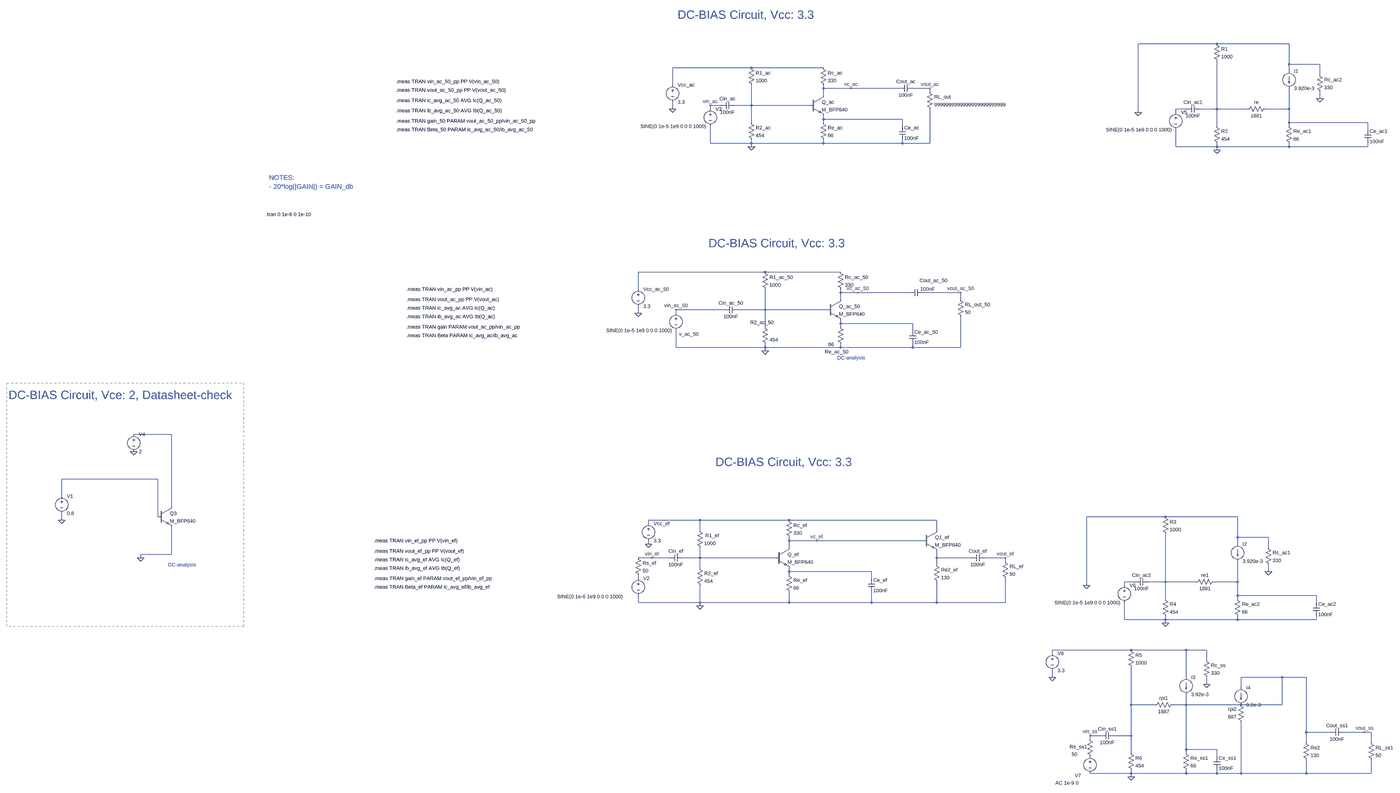
[diagram p0: schematic BP640_AC_3V.asc, whole sheet]
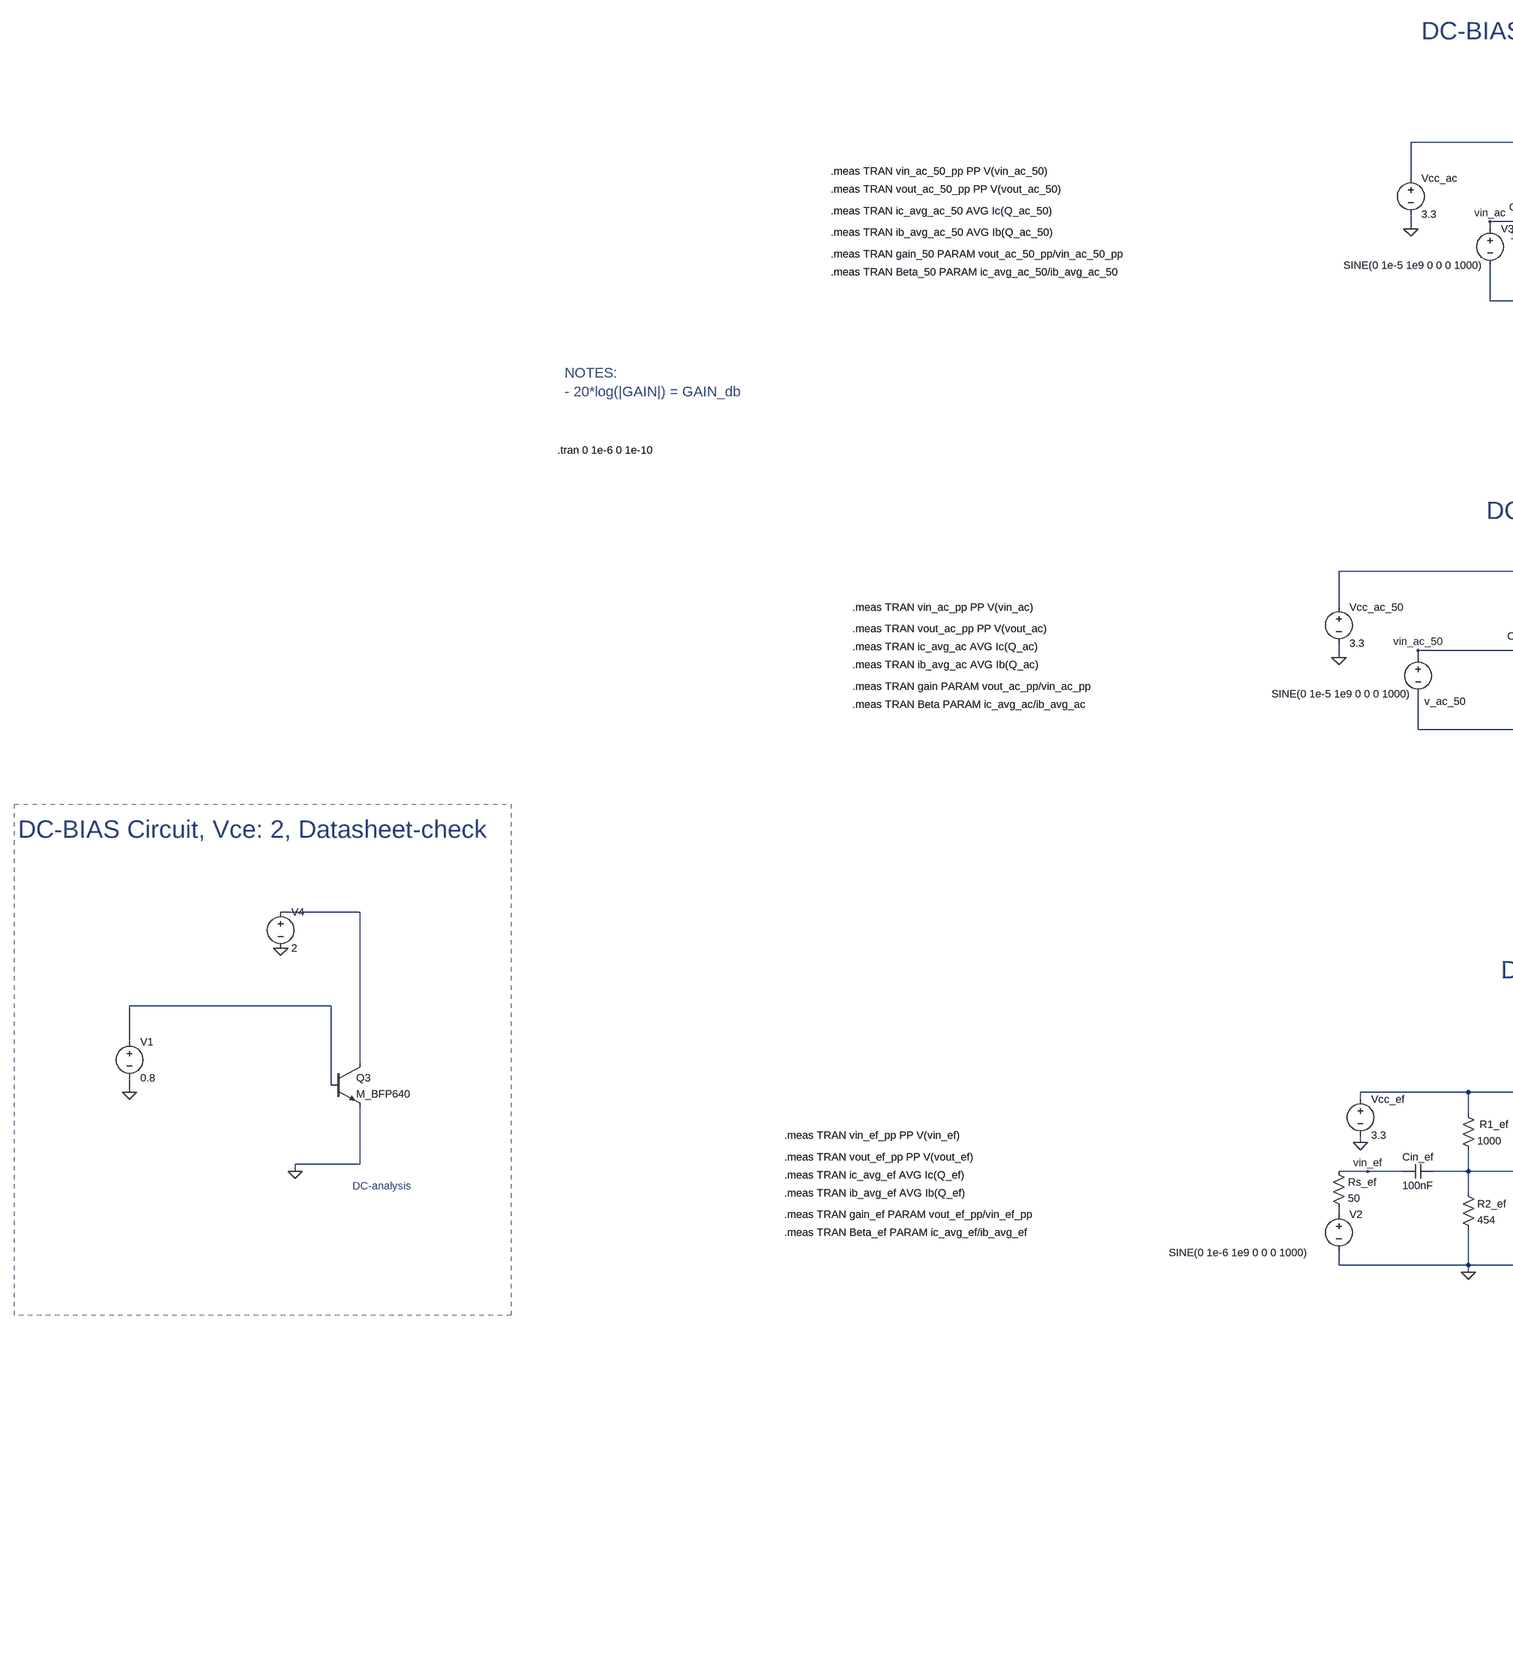
[diagram p1: schematic BP640_AC_3V.asc, part, row 1 of 1, column 1 of 2]
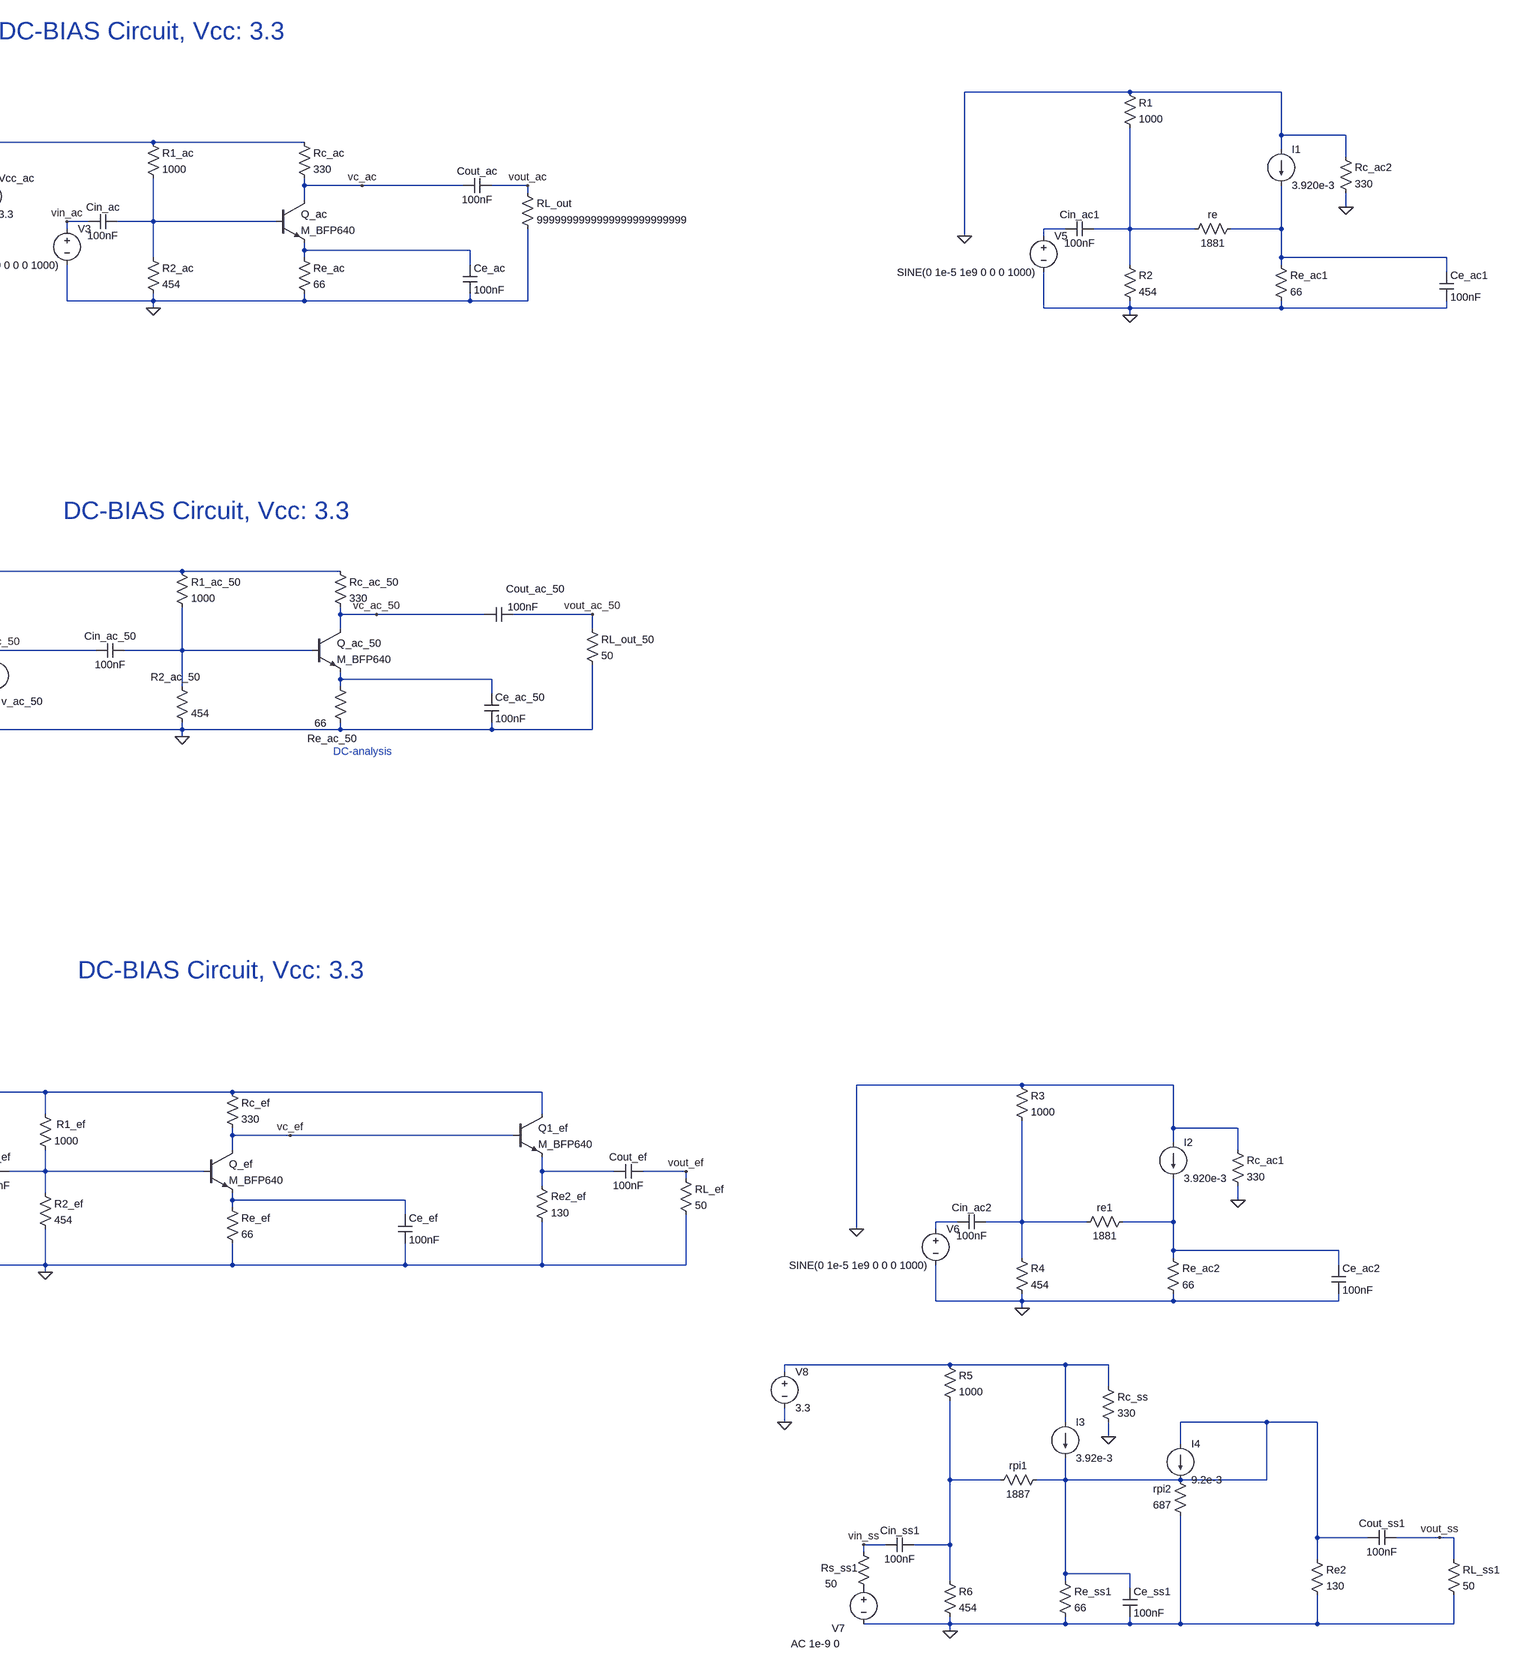
[diagram p2: schematic BP640_AC_3V.asc, part, row 1 of 1, column 2 of 2]
BP640_AC_3V.asc, the LTspice schematic file:
Version 4
SHEET 1 3412 4004
WIRE 2224 -224 1856 -224
WIRE 2560 -224 2224 -224
WIRE 2560 -128 2560 -224
WIRE 2704 -128 2560 -128
WIRE -352 -112 -720 -112
WIRE -16 -112 -352 -112
WIRE 2560 -96 2560 -128
WIRE 2704 -80 2704 -128
WIRE -720 -32 -720 -112
WIRE -16 -16 -16 -32
WIRE 112 -16 -16 -16
WIRE 336 -16 112 -16
WIRE 480 -16 400 -16
WIRE 480 0 480 -16
WIRE -16 16 -16 -16
WIRE 2704 32 2704 0
WIRE -496 64 -544 64
WIRE -352 64 -352 -32
WIRE -352 64 -432 64
WIRE -80 64 -352 64
WIRE -720 80 -720 48
WIRE -544 80 -544 64
WIRE 2080 80 2032 80
WIRE 2224 80 2224 -144
WIRE 2224 80 2144 80
WIRE 2368 80 2224 80
WIRE 2560 80 2560 -16
WIRE 2560 80 2448 80
WIRE 1856 96 1856 -224
WIRE 2032 96 2032 80
WIRE -16 128 -16 112
WIRE 352 128 -16 128
WIRE -352 144 -352 64
WIRE -16 144 -16 128
WIRE 2560 144 2560 80
WIRE 2928 144 2560 144
WIRE 352 160 352 128
WIRE 2224 160 2224 80
WIRE 2560 160 2560 144
WIRE 2928 176 2928 144
WIRE -544 240 -544 160
WIRE -352 240 -352 224
WIRE -352 240 -544 240
WIRE -16 240 -16 224
WIRE -16 240 -352 240
WIRE 352 240 352 224
WIRE 352 240 -16 240
WIRE 480 240 480 80
WIRE 480 240 352 240
WIRE -352 256 -352 240
WIRE 2032 256 2032 176
WIRE 2224 256 2224 240
WIRE 2224 256 2032 256
WIRE 2560 256 2560 240
WIRE 2560 256 2224 256
WIRE 2928 256 2928 240
WIRE 2928 256 2560 256
WIRE 2224 272 2224 256
WIRE -288 1216 -880 1216
WIRE 64 1216 -288 1216
WIRE -880 1296 -880 1216
WIRE 64 1312 64 1296
WIRE 144 1312 64 1312
WIRE 384 1312 144 1312
WIRE 624 1312 448 1312
WIRE 64 1344 64 1312
WIRE 624 1344 624 1312
WIRE -480 1392 -704 1392
WIRE -288 1392 -288 1296
WIRE -288 1392 -416 1392
WIRE 0 1392 -288 1392
WIRE -880 1408 -880 1376
WIRE -704 1408 -704 1392
WIRE 64 1456 64 1440
WIRE 400 1456 64 1456
WIRE -288 1472 -288 1392
WIRE 64 1472 64 1456
WIRE 400 1488 400 1456
WIRE -704 1568 -704 1488
WIRE -288 1568 -288 1552
WIRE -288 1568 -704 1568
WIRE 64 1568 64 1552
WIRE 64 1568 -288 1568
WIRE 400 1568 400 1552
WIRE 400 1568 64 1568
WIRE 624 1568 624 1424
WIRE 624 1568 400 1568
WIRE -288 1584 -288 1568
WIRE -3680 2112 -3856 2112
WIRE -3744 2320 -4192 2320
WIRE -4192 2400 -4192 2320
WIRE -3680 2448 -3680 2112
WIRE -3744 2496 -3744 2320
WIRE 1984 2496 1616 2496
WIRE 2320 2496 1984 2496
WIRE -4192 2512 -4192 2480
WIRE -592 2512 -832 2512
WIRE -176 2512 -592 2512
WIRE 512 2512 -176 2512
WIRE -832 2528 -832 2512
WIRE -592 2560 -592 2512
WIRE 512 2560 512 2512
WIRE 2320 2592 2320 2496
WIRE 2464 2592 2320 2592
WIRE -176 2608 -176 2592
WIRE -48 2608 -176 2608
WIRE 448 2608 -48 2608
WIRE -832 2624 -832 2608
WIRE 2320 2624 2320 2592
WIRE -176 2640 -176 2608
WIRE 2464 2640 2464 2592
WIRE -3680 2672 -3680 2544
WIRE -3680 2672 -3824 2672
WIRE -3824 2688 -3824 2672
WIRE -816 2688 -880 2688
WIRE -736 2688 -816 2688
WIRE -592 2688 -592 2640
WIRE -592 2688 -672 2688
WIRE -240 2688 -592 2688
WIRE 512 2688 512 2656
WIRE 672 2688 512 2688
WIRE 832 2688 736 2688
WIRE 832 2704 832 2688
WIRE 512 2720 512 2688
WIRE -592 2736 -592 2688
WIRE -176 2752 -176 2736
WIRE 208 2752 -176 2752
WIRE 2464 2752 2464 2720
WIRE -176 2768 -176 2752
WIRE -880 2784 -880 2768
WIRE 208 2784 208 2752
WIRE 1840 2800 1792 2800
WIRE 1984 2800 1984 2576
WIRE 1984 2800 1904 2800
WIRE 2128 2800 1984 2800
WIRE 2320 2800 2320 2704
WIRE 2320 2800 2208 2800
WIRE 1616 2816 1616 2496
WIRE 1792 2816 1792 2800
WIRE 2320 2864 2320 2800
WIRE 2688 2864 2320 2864
WIRE 1984 2880 1984 2800
WIRE 2320 2880 2320 2864
WIRE -880 2896 -880 2864
WIRE -592 2896 -592 2816
WIRE -592 2896 -880 2896
WIRE -176 2896 -176 2848
WIRE -176 2896 -592 2896
WIRE 208 2896 208 2848
WIRE 208 2896 -176 2896
WIRE 512 2896 512 2800
WIRE 512 2896 208 2896
WIRE 832 2896 832 2784
WIRE 832 2896 512 2896
WIRE 2688 2896 2688 2864
WIRE -592 2912 -592 2896
WIRE 1792 2976 1792 2896
WIRE 1984 2976 1984 2960
WIRE 1984 2976 1792 2976
WIRE 2320 2976 2320 2960
WIRE 2320 2976 1984 2976
WIRE 2688 2976 2688 2960
WIRE 2688 2976 2320 2976
WIRE 1984 2992 1984 2976
WIRE 1824 3296 1456 3296
WIRE 2080 3296 1824 3296
WIRE 2176 3296 2080 3296
WIRE 1456 3312 1456 3296
WIRE 2176 3344 2176 3296
WIRE 1456 3424 1456 3392
WIRE 2080 3424 2080 3296
WIRE 2528 3424 2336 3424
WIRE 2640 3424 2528 3424
WIRE 2176 3456 2176 3424
WIRE 2336 3472 2336 3424
WIRE 1824 3552 1824 3376
WIRE 1936 3552 1824 3552
WIRE 2080 3552 2080 3504
WIRE 2080 3552 2016 3552
WIRE 2336 3552 2080 3552
WIRE 2528 3552 2528 3424
WIRE 2528 3552 2336 3552
WIRE 2640 3680 2640 3424
WIRE 2752 3680 2640 3680
WIRE 2912 3680 2816 3680
WIRE 2944 3680 2912 3680
WIRE 1680 3696 1632 3696
WIRE 1824 3696 1824 3552
WIRE 1824 3696 1744 3696
WIRE 1632 3712 1632 3696
WIRE 2640 3728 2640 3680
WIRE 2944 3728 2944 3680
WIRE 2080 3760 2080 3552
WIRE 2224 3760 2080 3760
WIRE 1824 3776 1824 3696
WIRE 2080 3776 2080 3760
WIRE 2224 3792 2224 3760
WIRE 1824 3872 1824 3856
WIRE 1824 3872 1632 3872
WIRE 2080 3872 2080 3856
WIRE 2080 3872 1824 3872
WIRE 2224 3872 2224 3856
WIRE 2224 3872 2080 3872
WIRE 2336 3872 2336 3632
WIRE 2336 3872 2224 3872
WIRE 2640 3872 2640 3808
WIRE 2640 3872 2336 3872
WIRE 2944 3872 2944 3808
WIRE 2944 3872 2640 3872
WIRE 1824 3888 1824 3872
FLAG -720 80 0
FLAG -352 256 0
FLAG -4192 2512 0
FLAG -3824 2688 0
FLAG -3856 2192 0
FLAG -880 1408 0
FLAG -288 1584 0
FLAG -704 1392 vin_ac_50
FLAG 624 1312 vout_ac_50
FLAG -544 64 vin_ac
FLAG 480 -16 vout_ac
FLAG 112 -16 vc_ac
FLAG 144 1312 vc_ac_50
FLAG -832 2624 0
FLAG -592 2912 0
FLAG -816 2688 vin_ef
FLAG 832 2688 vout_ef
FLAG -48 2608 vc_ef
FLAG 1856 96 0
FLAG 2224 272 0
FLAG 2704 32 0
FLAG 1616 2816 0
FLAG 1984 2992 0
FLAG 2464 2752 0
FLAG 1456 3424 0
FLAG 1824 3888 0
FLAG 1632 3696 vin_ss
FLAG 2912 3680 vout_ss
FLAG 2176 3456 0
DATAFLAG 64 1312 ""
DATAFLAG 64 1328 ""
SYMBOL voltage -720 -48 R0
WINDOW 123 0 0 Left 0
WINDOW 39 0 0 Left 0
SYMATTR InstName Vcc_ac
SYMATTR Value 3.3
SYMBOL npn -80 16 R0
SYMATTR InstName Q_ac
SYMATTR Value M_BFP640
SYMBOL res -368 -128 R0
SYMATTR InstName R1_ac
SYMATTR Value 1000
SYMBOL res -368 128 R0
SYMATTR InstName R2_ac
SYMATTR Value 454
SYMBOL res -32 128 R0
SYMATTR InstName Re_ac
SYMATTR Value 66
SYMBOL res -32 -128 R0
SYMATTR InstName Rc_ac
SYMATTR Value 330
SYMBOL voltage -4192 2384 R0
WINDOW 123 0 0 Left 0
WINDOW 39 0 0 Left 0
SYMATTR InstName V1
SYMATTR Value 0.8
SYMBOL npn -3744 2448 R0
SYMATTR InstName Q3
SYMATTR Value M_BFP640
SYMBOL voltage -3856 2096 R0
WINDOW 123 0 0 Left 0
WINDOW 39 0 0 Left 0
SYMATTR InstName V4
SYMATTR Value 2
SYMBOL res 464 -16 R0
SYMATTR InstName RL_out
SYMATTR Value 9999999999999999999999999
SYMBOL cap 336 160 R0
SYMATTR InstName Ce_ac
SYMATTR Value 100nF
SYMBOL cap 400 -32 R90
WINDOW 0 0 32 VBottom 2
WINDOW 3 32 32 VTop 2
SYMATTR InstName Cout_ac
SYMATTR Value 100nF
SYMBOL cap -432 48 R90
WINDOW 0 0 32 VBottom 2
WINDOW 3 32 32 VTop 2
SYMATTR InstName Cin_ac
SYMATTR Value 100nF
SYMBOL voltage -544 64 R0
WINDOW 3 -326 97 Left 2
WINDOW 123 0 0 Left 0
WINDOW 39 0 0 Left 0
SYMATTR Value SINE(0 1e-5 1e9 0 0 0 1000)
SYMATTR InstName V3
SYMBOL voltage -880 1280 R0
WINDOW 123 0 0 Left 0
WINDOW 39 0 0 Left 0
SYMATTR InstName Vcc_ac_50
SYMATTR Value 3.3
SYMBOL npn 0 1344 R0
SYMATTR InstName Q_ac_50
SYMATTR Value M_BFP640
SYMBOL res -304 1200 R0
SYMATTR InstName R1_ac_50
SYMATTR Value 1000
SYMBOL res -304 1456 R0
WINDOW 0 -54 -5 Left 2
SYMATTR InstName R2_ac_50
SYMATTR Value 454
SYMBOL res 48 1456 R0
WINDOW 0 -58 132 Left 2
WINDOW 3 -42 98 Left 2
SYMATTR InstName Re_ac_50
SYMATTR Value 66
SYMBOL res 48 1200 R0
SYMATTR InstName Rc_ac_50
SYMATTR Value 330
SYMBOL res 608 1328 R0
SYMATTR InstName RL_out_50
SYMATTR Value 50
SYMBOL cap 384 1488 R0
SYMATTR InstName Ce_ac_50
SYMATTR Value 100nF
SYMBOL cap 448 1296 R90
WINDOW 0 -25 -49 VBottom 2
WINDOW 3 -16 -22 VTop 2
SYMATTR InstName Cout_ac_50
SYMATTR Value 100nF
SYMBOL cap -416 1376 R90
WINDOW 0 0 32 VBottom 2
WINDOW 3 32 32 VTop 2
SYMATTR InstName Cin_ac_50
SYMATTR Value 100nF
SYMBOL voltage -704 1392 R0
WINDOW 0 14 113 Left 2
WINDOW 3 -326 97 Left 2
WINDOW 123 0 0 Left 0
WINDOW 39 0 0 Left 0
SYMATTR InstName v_ac_50
SYMATTR Value SINE(0 1e-5 1e9 0 0 0 1000)
SYMBOL voltage -832 2512 R0
WINDOW 123 0 0 Left 0
WINDOW 39 0 0 Left 0
SYMATTR InstName Vcc_ef
SYMATTR Value 3.3
SYMBOL npn -240 2640 R0
SYMATTR InstName Q_ef
SYMATTR Value M_BFP640
SYMBOL res -608 2544 R0
WINDOW 0 41 40 Left 2
SYMATTR InstName R1_ef
SYMATTR Value 1000
SYMBOL res -608 2720 R0
SYMATTR InstName R2_ef
SYMATTR Value 454
SYMBOL res -192 2752 R0
SYMATTR InstName Re_ef
SYMATTR Value 66
SYMBOL res -192 2496 R0
SYMATTR InstName Rc_ef
SYMATTR Value 330
SYMBOL res 816 2688 R0
SYMATTR InstName RL_ef
SYMATTR Value 50
SYMBOL cap 192 2784 R0
SYMATTR InstName Ce_ef
SYMATTR Value 100nF
SYMBOL cap 736 2672 R90
WINDOW 0 0 32 VBottom 2
WINDOW 3 32 32 VTop 2
SYMATTR InstName Cout_ef
SYMATTR Value 100nF
SYMBOL cap -672 2672 R90
WINDOW 0 0 32 VBottom 2
WINDOW 3 32 32 VTop 2
SYMATTR InstName Cin_ef
SYMATTR Value 100nF
SYMBOL voltage -880 2768 R0
WINDOW 3 -378 101 Left 2
WINDOW 123 0 0 Left 0
WINDOW 39 0 0 Left 0
SYMATTR Value SINE(0 1e-6 1e9 0 0 0 1000)
SYMATTR InstName V2
SYMBOL npn 448 2560 R0
SYMATTR InstName Q1_ef
SYMATTR Value M_BFP640
SYMBOL res 496 2704 R0
SYMATTR InstName Re2_ef
SYMATTR Value 130
SYMBOL res -896 2672 R0
SYMATTR InstName Rs_ef
SYMATTR Value 50
SYMBOL res 2208 -240 R0
SYMATTR InstName R1
SYMATTR Value 1000
SYMBOL res 2208 144 R0
SYMATTR InstName R2
SYMATTR Value 454
SYMBOL res 2544 144 R0
SYMATTR InstName Re_ac1
SYMATTR Value 66
SYMBOL cap 2912 176 R0
SYMATTR InstName Ce_ac1
SYMATTR Value 100nF
SYMBOL cap 2144 64 R90
WINDOW 0 0 32 VBottom 2
WINDOW 3 32 32 VTop 2
SYMATTR InstName Cin_ac1
SYMATTR Value 100nF
SYMBOL voltage 2032 80 R0
WINDOW 3 -326 97 Left 2
WINDOW 123 0 0 Left 0
WINDOW 39 0 0 Left 0
SYMATTR Value SINE(0 1e-5 1e9 0 0 0 1000)
SYMATTR InstName V5
SYMBOL current 2560 -96 R0
WINDOW 123 0 0 Left 0
WINDOW 39 0 0 Left 0
SYMATTR InstName I1
SYMATTR Value 3.920e-3
SYMBOL res 2464 64 R90
WINDOW 0 0 56 VBottom 2
WINDOW 3 32 56 VTop 2
SYMATTR InstName re
SYMATTR Value 1881
SYMBOL res 2688 -96 R0
SYMATTR InstName Rc_ac2
SYMATTR Value 330
SYMBOL res 1968 2480 R0
SYMATTR InstName R3
SYMATTR Value 1000
SYMBOL res 1968 2864 R0
SYMATTR InstName R4
SYMATTR Value 454
SYMBOL res 2304 2864 R0
SYMATTR InstName Re_ac2
SYMATTR Value 66
SYMBOL cap 2672 2896 R0
SYMATTR InstName Ce_ac2
SYMATTR Value 100nF
SYMBOL cap 1904 2784 R90
WINDOW 0 0 32 VBottom 2
WINDOW 3 32 32 VTop 2
SYMATTR InstName Cin_ac2
SYMATTR Value 100nF
SYMBOL voltage 1792 2800 R0
WINDOW 3 -326 97 Left 2
WINDOW 123 0 0 Left 0
WINDOW 39 0 0 Left 0
SYMATTR Value SINE(0 1e-5 1e9 0 0 0 1000)
SYMATTR InstName V6
SYMBOL current 2320 2624 R0
WINDOW 123 0 0 Left 0
WINDOW 39 0 0 Left 0
SYMATTR InstName I2
SYMATTR Value 3.920e-3
SYMBOL res 2224 2784 R90
WINDOW 0 0 56 VBottom 2
WINDOW 3 32 56 VTop 2
SYMATTR InstName re1
SYMATTR Value 1881
SYMBOL res 2448 2624 R0
SYMATTR InstName Rc_ac1
SYMATTR Value 330
SYMBOL res 1808 3280 R0
SYMATTR InstName R5
SYMATTR Value 1000
SYMBOL res 1808 3760 R0
SYMATTR InstName R6
SYMATTR Value 454
SYMBOL res 2064 3760 R0
SYMATTR InstName Re_ss1
SYMATTR Value 66
SYMBOL res 2160 3328 R0
SYMATTR InstName Rc_ss
SYMATTR Value 330
SYMBOL cap 2208 3792 R0
SYMATTR InstName Ce_ss1
SYMATTR Value 100nF
SYMBOL cap 1744 3680 R90
WINDOW 0 0 32 VBottom 2
WINDOW 3 32 32 VTop 2
SYMATTR InstName Cin_ss1
SYMATTR Value 100nF
SYMBOL res 2624 3712 R0
SYMATTR InstName Re2
SYMATTR Value 130
SYMBOL voltage 1632 3776 R0
WINDOW 123 -162 140 Left 2
WINDOW 39 0 0 Left 0
WINDOW 0 -71 106 Left 2
SYMATTR Value2 AC 1e-9 0
SYMATTR InstName V7
SYMATTR Value ""
SYMBOL cap 2816 3664 R90
WINDOW 0 0 32 VBottom 2
WINDOW 3 32 32 VTop 2
SYMATTR InstName Cout_ss1
SYMATTR Value 100nF
SYMBOL res 2928 3712 R0
SYMATTR InstName RL_ss1
SYMATTR Value 50
SYMBOL res 1616 3696 R0
WINDOW 0 -79 52 Left 2
WINDOW 3 -70 87 Left 2
SYMATTR InstName Rs_ss1
SYMATTR Value 50
SYMBOL voltage 1456 3296 R0
WINDOW 123 0 0 Left 0
WINDOW 39 0 0 Left 0
SYMATTR InstName V8
SYMATTR Value 3.3
SYMBOL res 2032 3536 R90
WINDOW 0 0 56 VBottom 2
WINDOW 3 32 56 VTop 2
SYMATTR InstName rpi1
SYMATTR Value 1887
SYMBOL current 2080 3424 R0
WINDOW 123 0 0 Left 0
WINDOW 39 0 0 Left 0
SYMATTR InstName I3
SYMATTR Value 3.92e-3
SYMBOL res 2352 3648 R180
WINDOW 0 36 76 Left 2
WINDOW 3 36 40 Left 2
SYMATTR InstName rpi2
SYMATTR Value 687
SYMBOL current 2336 3472 R0
WINDOW 123 0 0 Left 0
WINDOW 39 0 0 Left 0
SYMATTR InstName I4
SYMATTR Value 9.2e-3
TEXT -2704 624 Left 2 !.tran 0 1e-6 0 1e-10
TEXT -696 -440 Left 5 ;DC-BIAS Circuit, Vcc: 3.3
TEXT -3696 2720 Left 2 ;DC-analysis
TEXT -4440 1928 Left 5 ;DC-BIAS Circuit, Vce: 2, Datasheet-check
TEXT 48 1616 Left 2 ;DC-analysis
TEXT -552 936 Left 5 ;DC-BIAS Circuit, Vcc: 3.3
TEXT -2688 400 Left 3 ;NOTES:\n- 20*log(|GAIN|) = GAIN_db
TEXT -2096 -48 Left 2 !.meas TRAN vin_ac_50_pp PP V(vin_ac_50)
TEXT -2096 -8 Left 2 !.meas TRAN vout_ac_50_pp PP V(vout_ac_50)
TEXT -2048 1296 Left 2 !.meas TRAN vin_ac_pp PP V(vin_ac)
TEXT -2048 1344 Left 2 !.meas TRAN vout_ac_pp PP V(vout_ac)
TEXT -2096 40 Left 2 !.meas TRAN ic_avg_ac_50 AVG Ic(Q_ac_50)
TEXT -2096 88 Left 2 !.meas TRAN ib_avg_ac_50 AVG Ib(Q_ac_50)
TEXT -2048 1384 Left 2 !.meas TRAN ic_avg_ac AVG Ic(Q_ac)
TEXT -2048 1424 Left 2 !.meas TRAN ib_avg_ac AVG Ib(Q_ac)
TEXT -2096 136 Left 2 !.meas TRAN gain_50 PARAM vout_ac_50_pp/vin_ac_50_pp
TEXT -2096 176 Left 2 !.meas TRAN Beta_50 PARAM ic_avg_ac_50/ib_avg_ac_50
TEXT -2048 1472 Left 2 !.meas TRAN gain PARAM vout_ac_pp/vin_ac_pp
TEXT -2048 1512 Left 2 !.meas TRAN Beta PARAM ic_avg_ac/ib_avg_ac
TEXT -520 2240 Left 5 ;DC-BIAS Circuit, Vcc: 3.3
TEXT -2200 2608 Left 2 !.meas TRAN vin_ef_pp PP V(vin_ef)
TEXT -2200 2656 Left 2 !.meas TRAN vout_ef_pp PP V(vout_ef)
TEXT -2200 2696 Left 2 !.meas TRAN ic_avg_ef AVG Ic(Q_ef)
TEXT -2200 2736 Left 2 !.meas TRAN ib_avg_ef AVG Ib(Q_ef)
TEXT -2200 2784 Left 2 !.meas TRAN gain_ef PARAM vout_ef_pp/vin_ef_pp
TEXT -2200 2824 Left 2 !.meas TRAN Beta_ef PARAM ic_avg_ef/ib_avg_ef
RECTANGLE Normal -3344 3008 -4448 1872 2

The netlist it stands for:
* BP640_AC_3V.asc
Vcc_ac N001 0 3.3
Q_ac vc_ac N002 N006 0 M_BFP640
R1_ac N001 N002 1000
R2_ac N002 0 454
Re_ac N006 0 66
Rc_ac N001 vc_ac 330
V1 N011 0 0.8
Q3 N010 N011 0 0 M_BFP640
V4 N010 0 2
RL_out vout_ac 0 9999999999999999999999999
Ce_ac N006 0 100nF
Cout_ac vout_ac vc_ac 100nF
Cin_ac N002 vin_ac 100nF
V3 vin_ac 0 SINE(0 1e-5 1e9 0 0 0 1000)
Vcc_ac_50 N007 0 3.3
Q_ac_50 vc_ac_50 N008 N009 0 M_BFP640
R1_ac_50 N007 N008 1000
R2_ac_50 N008 0 454
Re_ac_50 N009 0 66
Rc_ac_50 N007 vc_ac_50 330
RL_out_50 vout_ac_50 0 50
Ce_ac_50 N009 0 100nF
Cout_ac_50 vout_ac_50 vc_ac_50 100nF
Cin_ac_50 N008 vin_ac_50 100nF
v_ac_50 vin_ac_50 0 SINE(0 1e-5 1e9 0 0 0 1000)
Vcc_ef N012 0 3.3
Q_ef vc_ef N013 N015 0 M_BFP640
R1_ef N012 N013 1000
R2_ef N013 0 454
Re_ef N015 0 66
Rc_ef N012 vc_ef 330
RL_ef vout_ef 0 50
Ce_ef N015 0 100nF
Cout_ef vout_ef N014 100nF
Cin_ef N013 vin_ef 100nF
V2 N016 0 SINE(0 1e-6 1e9 0 0 0 1000)
Q1_ef N012 vc_ef N014 0 M_BFP640
Re2_ef N014 0 130
Rs_ef vin_ef N016 50
R1 0 N004 1000
R2 N004 0 454
Re_ac1 N005 0 66
Ce_ac1 N005 0 100nF
Cin_ac1 N004 N003 100nF
V5 N003 0 SINE(0 1e-5 1e9 0 0 0 1000)
I1 0 N005 3.920e-3
re N005 N004 1881
Rc_ac2 0 0 330
R3 0 N018 1000
R4 N018 0 454
Re_ac2 N019 0 66
Ce_ac2 N019 0 100nF
Cin_ac2 N018 N017 100nF
V6 N017 0 SINE(0 1e-5 1e9 0 0 0 1000)
I2 0 N019 3.920e-3
re1 N019 N018 1881
Rc_ac1 0 0 330
R5 N020 N022 1000
R6 N022 0 454
Re_ss1 N021 0 66
Rc_ss N020 0 330
Ce_ss1 N021 0 100nF
Cin_ss1 N022 vin_ss 100nF
Re2 N021 0 130
V7 P001 0 AC 1e-9 0
Cout_ss1 vout_ss N021 100nF
RL_ss1 vout_ss 0 50
Rs_ss1 vin_ss P001 50
V8 N020 0 3.3
rpi1 N021 N022 1887
I3 N020 N021 3.92e-3
rpi2 0 N021 687
I4 N021 N021 9.2e-3
.model NPN NPN
.model PNP PNP
.lib standard.bjt
.tran 0 1e-6 0 1e-10
* DC-BIAS Circuit, Vcc: 3.3
* DC-analysis
* DC-BIAS Circuit, Vce: 2, Datasheet-check
* DC-analysis
* DC-BIAS Circuit, Vcc: 3.3
* NOTES:
* - 20*log(|GAIN|) = GAIN_db
.meas TRAN vin_ac_50_pp PP V(vin_ac_50)
.meas TRAN vout_ac_50_pp PP V(vout_ac_50)
.meas TRAN vin_ac_pp PP V(vin_ac)
.meas TRAN vout_ac_pp PP V(vout_ac)
.meas TRAN ic_avg_ac_50 AVG Ic(Q_ac_50)
.meas TRAN ib_avg_ac_50 AVG Ib(Q_ac_50)
.meas TRAN ic_avg_ac AVG Ic(Q_ac)
.meas TRAN ib_avg_ac AVG Ib(Q_ac)
.meas TRAN gain_50 PARAM vout_ac_50_pp/vin_ac_50_pp
.meas TRAN Beta_50 PARAM ic_avg_ac_50/ib_avg_ac_50
.meas TRAN gain PARAM vout_ac_pp/vin_ac_pp
.meas TRAN Beta PARAM ic_avg_ac/ib_avg_ac
* DC-BIAS Circuit, Vcc: 3.3
.meas TRAN vin_ef_pp PP V(vin_ef)
.meas TRAN vout_ef_pp PP V(vout_ef)
.meas TRAN ic_avg_ef AVG Ic(Q_ef)
.meas TRAN ib_avg_ef AVG Ib(Q_ef)
.meas TRAN gain_ef PARAM vout_ef_pp/vin_ef_pp
.meas TRAN Beta_ef PARAM ic_avg_ef/ib_avg_ef
.backanno
.end